# Altium schematic sheet I2CShifter.SchDoc
size A
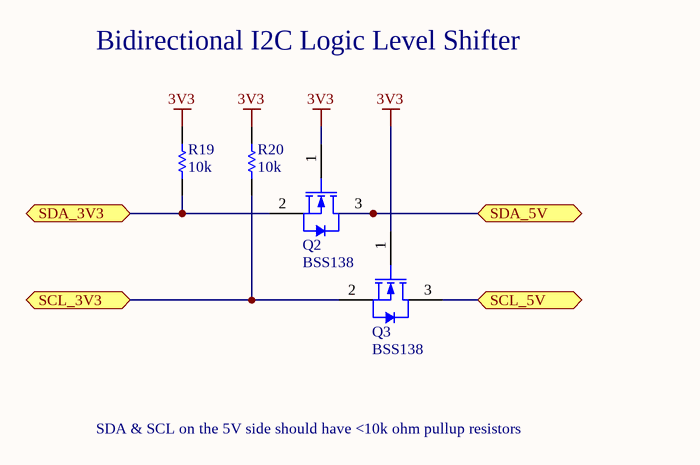
[diagram p0: I2CShifter.SchDoc]

## Parts
Q2  BSS138  [FAIR-SOT23-3_V]
Q3  BSS138  [FAIR-SOT23-3_V]
R19  10k  [RESC0603(1608)_L]
R20  10k  [RESC0603(1608)_L]

## Ports
SCL_3V3 (bidir), SCL_5V (bidir), SDA_3V3 (bidir), SDA_5V (bidir)

## Nets
3V3: Q2.1(G) Q3.1(G) R19.2 R20.2
SCL_3V3: Q3.2(S) R20.1 ; port SCL_3V3
SCL_5V: Q3.3(D) ; port SCL_5V
SDA_3V3: Q2.2(S) R19.1 ; port SDA_3V3
SDA_5V: Q2.3(D) ; port SDA_5V

## Notes on the sheet
- Bidirectional I2C Logic Level Shifter
- SDA & SCL on the 5V side should have <10k ohm pullup resistors

## Library data of the parts
Q2 Q3 = CMP-1670-00009-1: N-Channel Logic Level Enhancement Mode Field Effect Transistor, 220 mA, 50 V, -55 to 150 degC, 3-Pin SOT-23, RoHS, Tape and Reel; ESR: 40 Ohm; Tolerance: 30ppm; Capacitance: 1.8E-11 f; Load Capacitance: 18 pF; Frequency: 12 MHz; Resistance: 100 Ohm; Min Operating Temperature: -20degC; ComponentLink2URL: https://www.fairchildsemi.com/datasheets/BS/BSS138.pdf; Max Operating Temperature: 70degC; Width: 0.126 inch; Pins: 4; Length: 0.197 inch; ComponentLink2Description: Datasheet; Package Quantity: 1; PackageReference: SOT23-3; Packaging: Tape and Reel; RoHSCompliant: True; Frequency Tolerance: 30ppm; ComponentLink3Description: Package Specification; Mount: Surface Mount; REACH SVHC: Unknown; Height: 0.041 inch; ComponentLink1URL: https://www.fairchildsemi.com/; PackageDescription: 3-Pin Small Outline Transistor, Body 2.92 x 1.325 mm, Pitch 0.95 mm; ComponentLink3URL: http://www.fairchildsemi.com/dwg/MA/MA03D.pdf; ComponentLink1Description: Manufacturer URL; DatasheetVersion: Rev. C, 10/2005
R19 R20 = CMP-1012-00098-1: 10K 0.1W 5% 0603 (1608 Metric)  SMD; Case-EIA: 0603; Value: 10000.00 Ohm; Case-Metric: 1608; Technology: SMT; Tolerance: 5 %; Power: 0.1 W